# EasyEDA Pro project ProPrj_DCDC_LDO降压电路_2025-04-18.epro

# Schematic Schematic1
Board Name: Board1; Create Date: 2025-02-16; Page Name: P1; Project Name: 智能车主板; Schematic Name: Schematic1; Update Date: 2025-03-14; Company: 嘉立创EDA; Page Size: A4; Version: V1.0
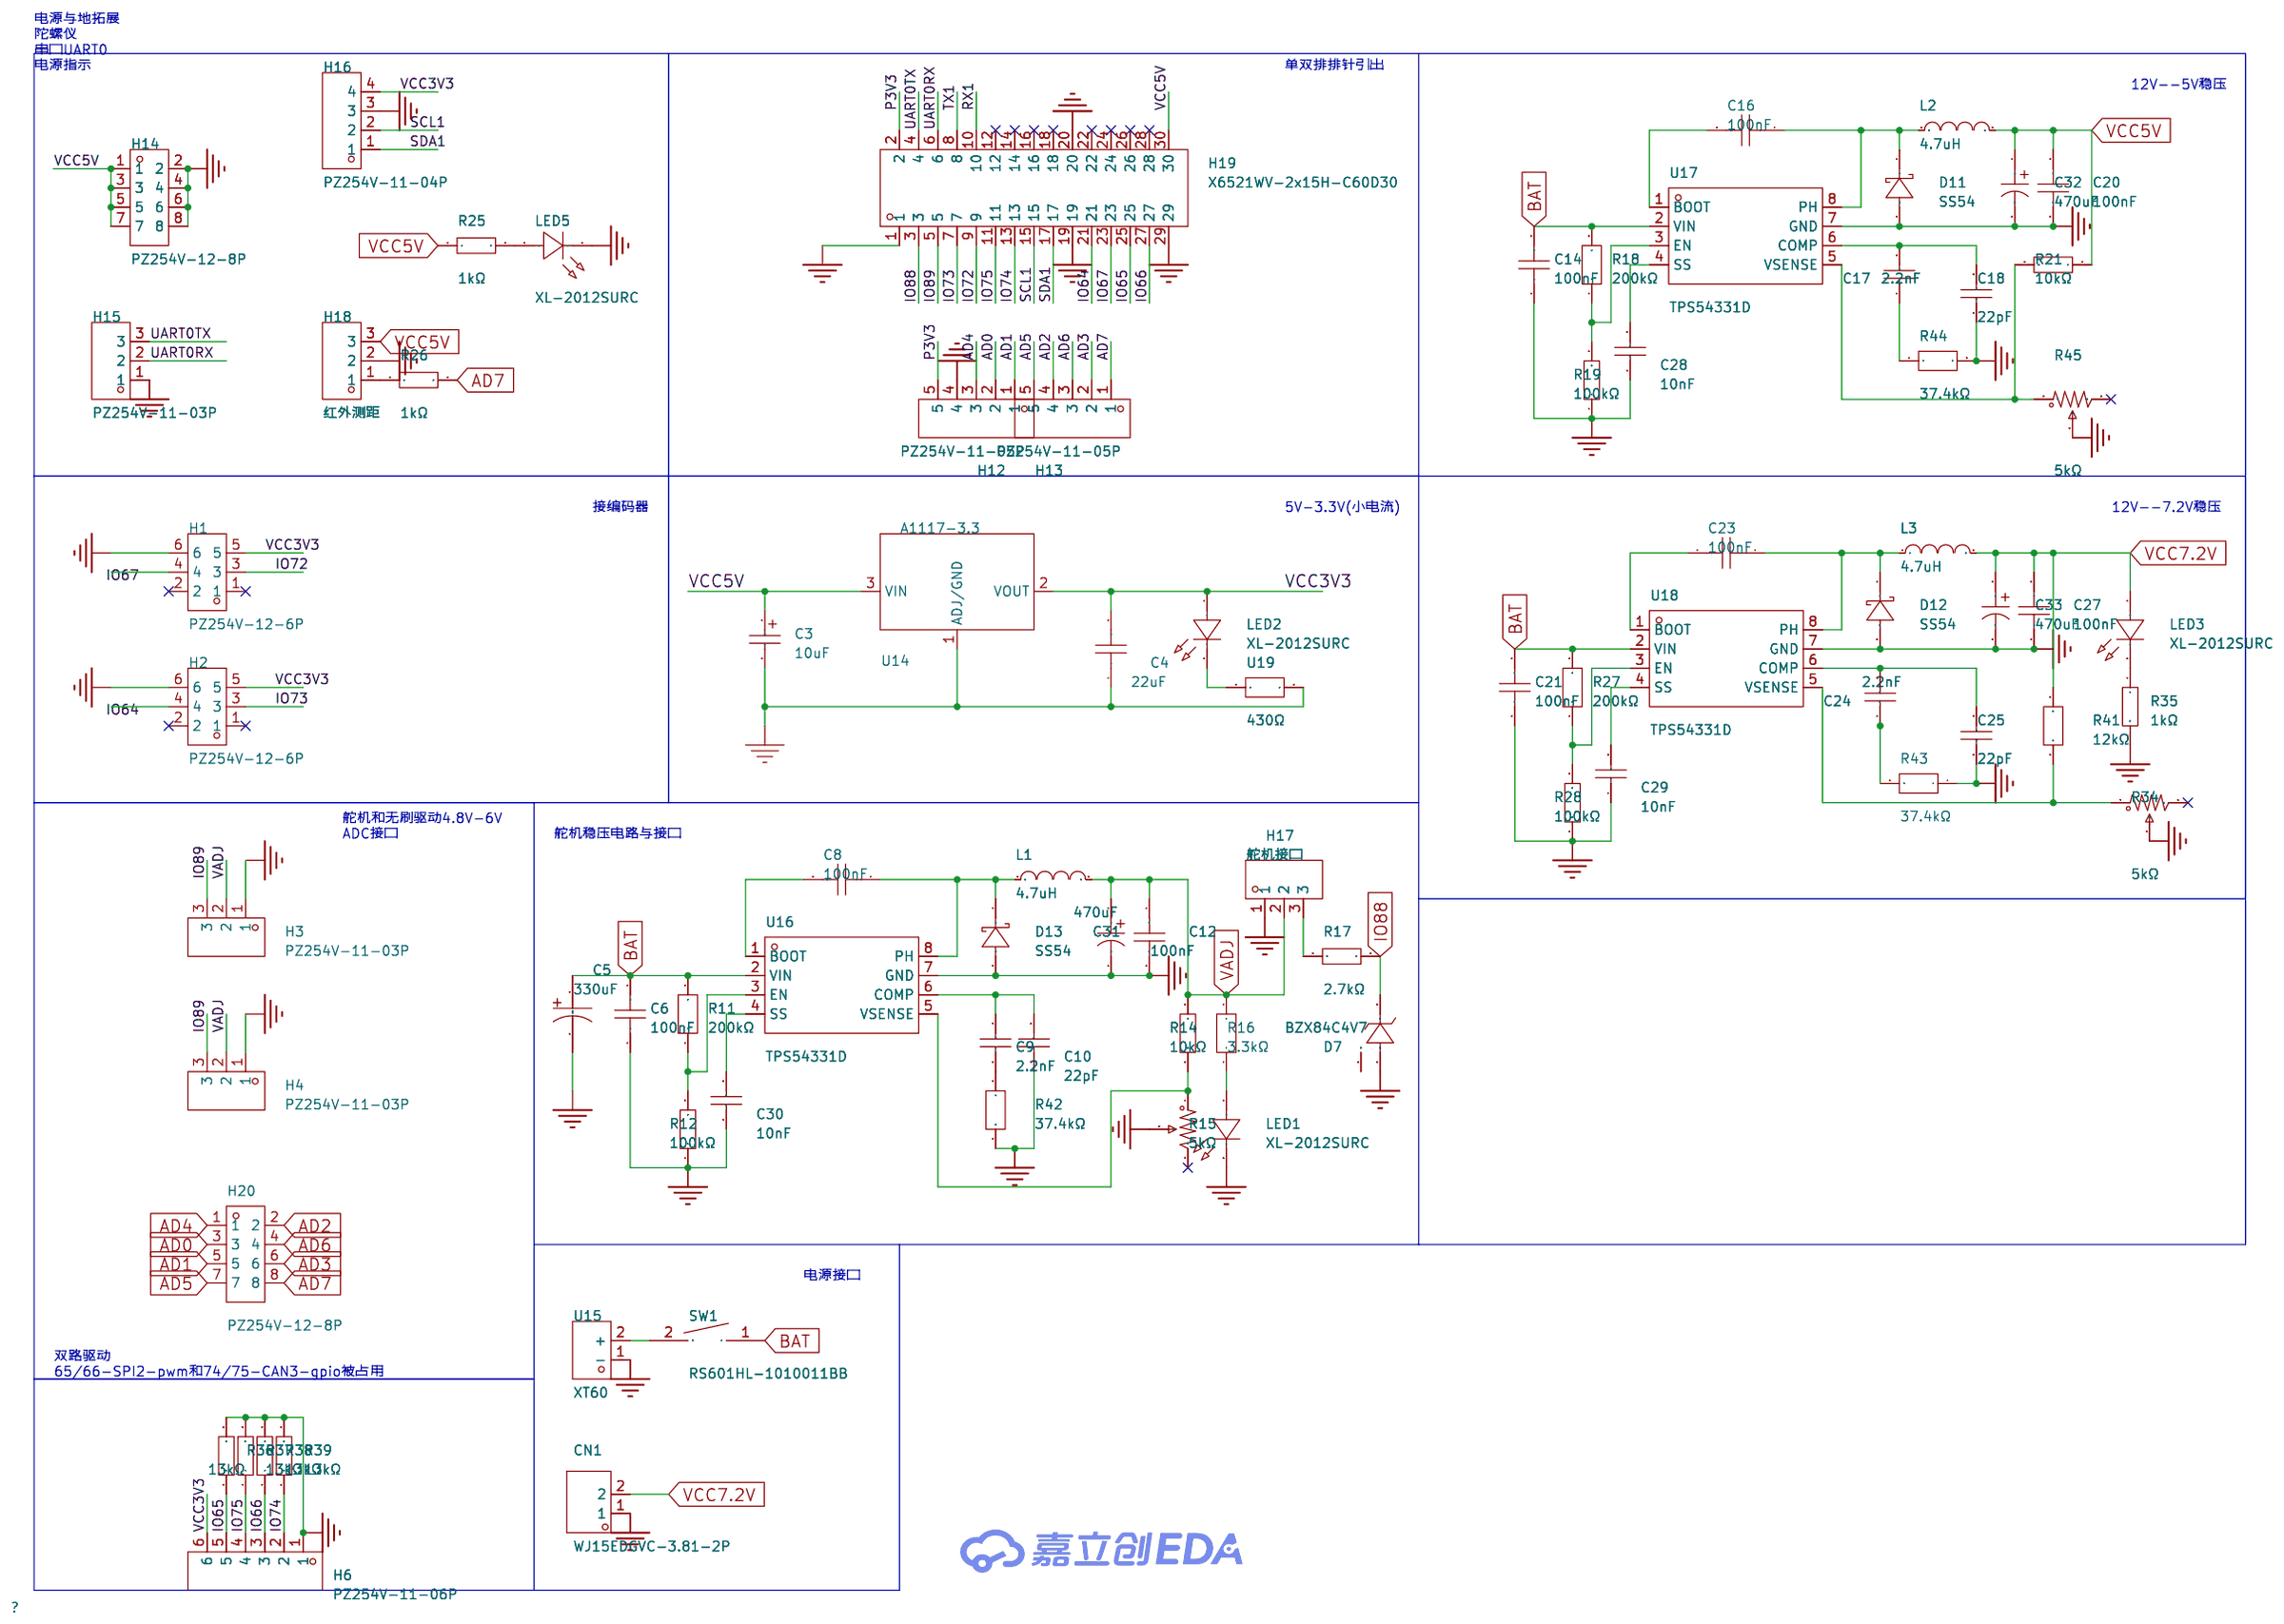
[diagram p0: schematic sheet]

## Parts
C3  10uF  [CAP-SMD_L6.0-W3.2]
C4  22uF  [C0805]
C5  330uF  [CAP-SMD_BD8.0-L8.3-W8.3-LS9.3-FD-1]
C6  100nF  [C0805]
C8  100nF  [C0805]
C9  2.2nF  [C0805]
C10  22pF  [C0603]
C12  100nF  [C0805]
C14  100nF  [C0805]
C16  100nF  [C0805]
C17  2.2nF  [C0805]
C18  22pF  [C0603]
C20  100nF  [C0805]
C21  100nF  [C0805]
C23  100nF  [C0805]
C24  2.2nF  [C0805]
C25  22pF  [C0603]
C27  100nF  [C0805]
C28  10nF  [C0805]
C29  10nF  [C0805]
C30  10nF  [C0805]
C31  470uF  [CAP-SMD_BD8.0-L8.3-W8.3-LS8.9-FD]
C32  470uF  [CAP-SMD_BD8.0-L8.3-W8.3-LS8.9-FD]
C33  470uF  [CAP-SMD_BD8.0-L8.3-W8.3-LS8.9-FD]
CN1  WJ15EDGVC-3.81-2P  [CONN-TH_WJ15EDGVC-3.81-2P]
D7  BZX84C4V7  [SOT-23-3_L2.9-W1.3-P1.90-LS2.4-BR]
D11  SS54  [SMA_L4.3-W2.6-LS5.0-RD]
D12  SS54  [SMA_L4.3-W2.6-LS5.0-RD]
D13  SS54  [SMA_L4.3-W2.6-LS5.0-RD]
H1  PZ254V-12-6P  [HDR-TH_6P-P2.54-V-M-R2-C3-S2.54]
H2  PZ254V-12-6P  [HDR-TH_6P-P2.54-V-M-R2-C3-S2.54]
H3  PZ254V-11-03P  [HDR-TH_3P-P2.54-V-M]
H4  PZ254V-11-03P  [HDR-TH_3P-P2.54-V-M]
H6  PZ254V-11-06P  [HDR-TH_6P-P2.54-V-M]
H12  PZ254V-11-05P  [HDR-TH_5P-P2.54-V-M]
H13  PZ254V-11-05P  [HDR-TH_5P-P2.54-V-M]
H14  PZ254V-12-8P  [HDR-TH_8P-P2.54-V-M-R2-C4-S2.54]
H15  PZ254V-11-03P  [HDR-TH_3P-P2.54-V-M]
H16  PZ254V-11-04P  [HDR-TH_4P-P2.54-V-M]
H17  舵机接口  [HDR-TH_3P-P2.54-V-M]
H18  红外测距  [HDR-TH_3P-P2.54-V-M]
H19  X6521WV-2x15H-C60D30  [HDR-TH_30P-P2.54-V-M-R2-C15-S2.54-BL]
H20  PZ254V-12-8P  [HDR-TH_8P-P2.54-V-M-R2-C4-S2.54]
L1  4.7uH  [IND-SMD_L7.3-W6.6_MHCI06030]
L2  4.7uH  [IND-SMD_L7.3-W6.6_MHCI06030]
L3  4.7uH  [IND-SMD_L7.3-W6.6_MHCI06030]
LED1  XL-2012SURC  [LED0805-R-RD]
LED2  XL-2012SURC  [LED0805-R-RD]
LED3  XL-2012SURC  [LED0805-R-RD]
LED5  XL-2012SURC  [LED0805-R-RD]
R11  200kΩ  [R0603]
R12  100kΩ  [R0805]
R14  10kΩ  [R0805]
R15  5kΩ  [RES-ADJ-TH_3P-L6.8-W4.6-P2.50-TL-BS-3266X]
R16  3.3kΩ  [R0805]
R17  2.7kΩ  [R0603]
R18  200kΩ  [R0603]
R19  100kΩ  [R0805]
R21  10kΩ  [R0805]
R25  1kΩ  [R0603]
R26  1kΩ  [R0603]
R27  200kΩ  [R0603]
R28  100kΩ  [R0805]
R34  5kΩ  [RES-ADJ-TH_3P-L6.8-W4.6-P2.50-TL-BS-3266X]
R35  1kΩ  [R0603]
R36  13kΩ  [R0805]
R37  13kΩ  [R0805]
R38  13kΩ  [R0805]
R39  13kΩ  [R0805]
R41  12kΩ  [R0805]
R42  37.4kΩ  [R0603]
R43  37.4kΩ  [R0603]
R44  37.4kΩ  [R0603]
R45  5kΩ  [RES-ADJ-TH_3P-L6.8-W4.6-P2.50-TL-BS-3266X]
SW1  RS601HL-1010011BB  [SW-TH_RS601HL-1010011BB]
U14  A1117-3.3  [asm1117]
U15  XT60  [CONN-TH_XT60]
U16  TPS54331D  [SOIC-8_L4.9-W3.9-P1.27-LS6.0-BL]
U17  TPS54331D  [SOIC-8_L4.9-W3.9-P1.27-LS6.0-BL]
U18  TPS54331D  [SOIC-8_L4.9-W3.9-P1.27-LS6.0-BL]
U19  430Ω  [R0805]

## Library data of the parts
C3 = TAJC106K016RNJ: 容值:10uF;精度:±10%;额定电压:16V;等效串联电阻:2Ω@100kHz;; LCSC Part Name: 10uF ±10% 16V; Supplier Part: C7209; Manufacturer: Kyocera AVX; Supplier Footprint: CASE-C-6032; JLCPCB Part Class: 扩展库; Datasheet: https://atta.szlcsc.com/upload/public/pdf/source/20160107/1457707750344.pdf; Supplier: LCSC; Tolerance: ±10%; Rated Voltage: 16V; Equivalent Series Resistance(ESR): 2Ω@100kHz; Operating Temperature: -55℃~+125℃
C4 = CGA0805X5R226M350MT: 容值:22uF;精度:±20%;额定电压:35V;材质(温度系数):X5R;; LCSC Part Name: 22uF ±20% 35V; Supplier Part: C6119901; Manufacturer: HRE(芯声); Supplier Footprint: 0805; JLCPCB Part Class: 扩展库; Datasheet: https://atta.szlcsc.com/upload/public/pdf/source/20231129/D589D0CC4D260F7AC3A77E53B455CCB3.pdf; Supplier: LCSC; Tolerance: ±20%; Voltage Rated: 35V; Temperature Coefficient: X5R
C5 = RVT1E331M0810_C335985: 容值:330uF;精度:±20%;额定电压:25V;纹波电流:228mA@120Hz;等效串联电阻(ESR):-;; LCSC Part Name: 330uF ±20% 25V; Supplier Part: C335985; Manufacturer: ROQANG(容强); Manufacturer Part: RVT1E331M0810; Supplier Footprint: SMD,D8xL10.2mm; JLCPCB Part Class: Extended Part; Datasheet: https://atta.szlcsc.com/upload/public/pdf/source/20181128/C335987_23CA7AA50FB42690DF736C43FE112376.pdf; Supplier: LCSC; Tolerance: ±20%; Voltage Rating: 25V; Ripple Current: 228mA@120Hz; Diameter: 8mm; Height - Seated (Max): 10.2mm; Lifetime: 2000hrs@105℃; Operating Temperature: -40℃~+105℃
C6 C8 C12 C14 C16 C20 C21 C23 C27 = CC0805KRX7R9BB104: 容值:100nF;精度:±10%;额定电压:50V;材质(温度系数):X7R;; LCSC Part Name: 100nF ±10% 50V; Supplier Part: C49678; Manufacturer: YAGEO(国巨); Supplier Footprint: 0805; JLCPCB Part Class: 基础库; Datasheet: https://atta.szlcsc.com/upload/public/pdf/source/20180224/C181747_15194369449651363981.pdf; Supplier: LCSC; Tolerance: ±10%; Voltage Rated: 50V; Temperature Coefficient: X7R
C9 C17 C24 = CL21C222JBFNNNE: 容值:2.2nF;精度:±5%;额定电压:50V;材质(温度系数):C0G;; LCSC Part Name: 2.2nF ±5% 50V; Supplier Part: C28260; Manufacturer: SAMSUNG(三星); Supplier Footprint: 0805; JLCPCB Part Class: 基础库; Datasheet: https://atta.szlcsc.com/upload/public/pdf/source/20160218/1457707763339.pdf; Supplier: LCSC; Tolerance: ±5%; Voltage Rated: 50V; Temperature Coefficient: C0G
C10 C18 C25 = CC0603JRNPO9BN220: 容值:22pF;精度:±5%;额定电压:50V;材质(温度系数):NP0;; LCSC Part Name: 22pF ±5% 50V; Supplier Part: C105620; Manufacturer: YAGEO(国巨); Supplier Footprint: 0603; JLCPCB Part Class: 扩展库; Datasheet: https://atta.szlcsc.com/upload/public/pdf/source/20170505/1493957838062.pdf; Supplier: LCSC; Tolerance: ±5%; Voltage Rated: 50V; Temperature Coefficient: NP0
C28-C30 = CL21B103KBANNNC: 容值:10nF;精度:±10%;额定电压:50V;材质(温度系数):X7R;; LCSC Part Name: 10nF ±10% 50V; Supplier Part: C1710; Manufacturer: SAMSUNG(三星); Supplier Footprint: 0805; JLCPCB Part Class: 基础库; Datasheet: https://atta.szlcsc.com/upload/public/pdf/source/20160218/1457707763339.pdf; Supplier: LCSC; Tolerance: ±10%; Voltage Rated: 50V; Temperature Coefficient: X7R
C31-C33 = CK1C471M-CRF10_C5162359: 容值:470uF;精度:±20%;额定电压:16V;纹波电流:240mA@120Hz;; LCSC Part Name: 470uF ±20% 16V; Supplier Part: C5162359; Manufacturer: ROQANG(容强); Manufacturer Part: CK1C471M-CRF10; Supplier Footprint: SMD,D8xL10.5mm; JLCPCB Part Class: Extended Part; Datasheet: https://atta.szlcsc.com/upload/public/pdf/source/20220915/8032839608EC75446813685B95DE3107.pdf; Supplier: LCSC; Tolerance: ±20%; Voltage Rating: 16V; Ripple Current: 240mA@120Hz; Diameter: 8mm; Height - Seated (Max): 10.5mm; Lifetime: 2000hrs@105℃; Operating Temperature: -40℃~+105℃
CN1 = WJ15EDGVC-3.81-2P: 连接器类型:板端/插座-闭口;固定方式:-;结构:1x2P;间距:3.81mm;颜色:-;安装方式:直针;排数:1;每排PIN数:2;额定电流:8A;额定电压:300V;线规 - AWG:-;线规 - 平方毫米:-;触头材质:黄铜;触头镀层:锡;工作温度范围:-40℃~+105℃;焊接温度(最大值):-;; LCSC Part Name: 1x2P 3.81mm 排数:1 每排P数:2; Supplier Part: C8396; Manufacturer: KANGNEX(康奈克斯电气); Supplier Footprint: 插件,P=3.81mm; JLCPCB Part Class: 扩展库; Datasheet: https://atta.szlcsc.com/upload/public/pdf/source/20191225/C8396_DFFE6D58C2AF45781C2AF0BF2B733CCC.pdf; Supplier: LCSC; Connector Type: 板端/插座-闭口; Structure: 1x2P; Pitch: 3.81mm; Mounting Style: 直针; Number of Pins: 2P; Number of Rows: 1; Number of PINs Per Row: 2; Current Rating (Max): 8A; Voltage Rating (Max): 300V; Contact Material: 黄铜; Contact Plating: 锡; Operating Temperature Range: -40℃~+105℃
D7 = BZX84C4V7_C841158: 二极管配置:独立式;稳压值(标称值):4.7V;稳压值(范围):4.4V~5V;耗散功率(Pd):350mW;; LCSC Part Name: 丝印Z1 BZX84C4V7; Supplier Part: C841158; Manufacturer: LGE(鲁光); Supplier Footprint: SOT-23; JLCPCB Part Class: 扩展库; Datasheet: https://atta.szlcsc.com/upload/public/pdf/source/20200521/C545312_81C845D7ABF6A946CB07E989BC227756.pdf; Supplier: LCSC; Diode Configuration: 独立式; Zener Voltage(Nom): 4.7V; Reverse Leakage Current (Ir): 3uA@2V; Zener Voltage(Range): 4.4V~5V; Pd - Power Dissipation: 350mW; Impedance(Zzt): 80Ω
D11-D13 = SS54_C727065: 二极管配置:独立式;正向压降(Vf):550mV@5A;直流反向耐压(Vr):40V;整流电流:5A;; LCSC Part Name: 电压:40V 电流:5A; Supplier Part: C727065; Manufacturer: TWGMC(台湾迪嘉); Supplier Footprint: SMA(DO-214AC); JLCPCB Part Class: 扩展库; Datasheet: https://atta.szlcsc.com/upload/public/pdf/source/20200828/C727064_BD0A2B36CBC76CEA4B6710C57718D41F.pdf; Supplier: LCSC; Diode Configuration: 独立式; Forward Voltage (Vf@If): 550mV@5A; Reverse Voltage (Vr): 40V; Rectified Current: 5A; Reverse Leakage Current (Ir): 500uA
H1 H2 = PZ254V-12-6P: 插针结构:2x3P;间距:2.54mm;行距:2.54mm;圆针/方针:方针;安装类型:直插;排数:双排;总PIN位数:6P;额定电流:-;额定电压:-;配合针长度:6mm;塑高:2.5mm;端接针长度:3mm;触头材质:黄铜;触头镀层:-;工作温度范围:-40℃~+105℃;颜色:黑色;; LCSC Part Name: 间距:2.54mm 2x3P 直插 方针; Supplier Part: C492420; Manufacturer: XFCN(兴飞); Supplier Footprint: 插件,P=2.54mm; JLCPCB Part Class: 扩展库; Datasheet: https://atta.szlcsc.com/upload/public/pdf/source/20200309/C492420_BAECB307B001054C09D200388220EAE6.pdf; Supplier: LCSC; Pin Structure: 2x3P; Pitch: 2.54mm; Row Spacing: 2.54mm; Circluar Pins/Square Pins: 方针; Mounting Type: 直插; Number of Rows: 双排; Number of Pins: 6P; Length of Mating Pin: 6mm; Insulation Height: 2.5mm; Length of End Connection Pin: 3mm; Contact Material: 黄铜; Operating Temperature Range: -40℃~+105℃; Color: 黑色
H3 H4 H15 H17 H18 = PZ254V-11-03P: 插针结构:1x3P;间距:2.54mm;行距:-;圆针/方针:方针;安装类型:直插;排数:单排;总PIN位数:3P;额定电流:3A;额定电压:250V;配合针长度:6mm;塑高:2.5mm;端接针长度:3mm;工作温度范围:-40℃~+105℃;颜色:黑色;; LCSC Part Name: 间距:2.54mm 1x3P 直插 方针; Supplier Part: C2937625; Manufacturer: XFCN(兴飞); Supplier Footprint: 插件,P=2.54mm; JLCPCB Part Class: 扩展库; Datasheet: https://atta.szlcsc.com/upload/public/pdf/source/20200309/C492402_8335C3D49C4E4C618838D59BB1D024C1.pdf; Supplier: LCSC; Pin Structure: 1x3P; Pitch: 2.54mm; Circluar Pins/Square Pins: 方针; Mounting Type: 直插; Number of Rows: 单排; Number of Pins: 3P; Current Rating (Max): 3A; Voltage Rating (Max): 250V; Length of Mating Pin: 6mm; Insulation Height: 2.5mm; Length of End Connection Pin: 3mm; Operating Temperature Range: -40℃~+105℃; Color: 黑色
H6 = PZ254V-11-06P: 插针结构:1x6P;间距:2.54mm;行距:-;圆针/方针:方针;安装类型:直插;排数:单排;总PIN位数:6P;额定电流:-;额定电压:-;配合针长度:6mm;塑高:2.5mm;端接针长度:3mm;触头材质:黄铜;触头镀层:-;工作温度范围:-40℃~+105℃;颜色:黑色;; LCSC Part Name: 间距:2.54mm 1x6P 直插 方针; Supplier Part: C492405; Manufacturer: XFCN(兴飞); Supplier Footprint: 插件,P=2.54mm; JLCPCB Part Class: 扩展库; Datasheet: https://atta.szlcsc.com/upload/public/pdf/source/20200309/C492405_597F1930F5B55CC3C7FD95458F1C3977.pdf; Supplier: LCSC; Pin Structure: 1x6P; Pitch: 2.54mm; Circluar Pins/Square Pins: 方针; Mounting Type: 直插; Number of Rows: 单排; Number of Pins: 6P; Length of Mating Pin: 6mm; Insulation Height: 2.5mm; Length of End Connection Pin: 3mm; Contact Material: 黄铜; Operating Temperature Range: -40℃~+105℃; Color: 黑色
H12 H13 = PZ254V-11-05P: 插针结构:1x5P;间距:2.54mm;行距:-;圆针/方针:方针;安装类型:直插;排数:单排;总PIN位数:5P;额定电流:-;额定电压:-;配合针长度:6mm;塑高:2.5mm;端接针长度:3mm;触头材质:黄铜;触头镀层:-;工作温度范围:-40℃~+105℃;颜色:黑色;; LCSC Part Name: 间距:2.54mm 1x5P 直插 方针; Supplier Part: C492404; Manufacturer: XFCN(兴飞); Supplier Footprint: 插件,P=2.54mm; JLCPCB Part Class: 扩展库; Datasheet: https://atta.szlcsc.com/upload/public/pdf/source/20200309/C492404_E51533260F8710EFF5D4617281164C1D.pdf; Supplier: LCSC; Pin Structure: 1x5P; Pitch: 2.54mm; Circluar Pins/Square Pins: 方针; Mounting Type: 直插; Number of Rows: 单排; Number of Pins: 5P; Length of Mating Pin: 6mm; Insulation Height: 2.5mm; Length of End Connection Pin: 3mm; Contact Material: 黄铜; Operating Temperature Range: -40℃~+105℃; Color: 黑色
H14 H20 = PZ254V-12-8P: 插针结构:2x4P;间距:2.54mm;行距:2.54mm;圆针/方针:方针;安装类型:直插;排数:双排;总PIN位数:8P;额定电流:-;额定电压:-;配合针长度:6mm;塑高:2.5mm;端接针长度:3mm;触头材质:黄铜;触头镀层:-;工作温度范围:-40℃~+105℃;颜色:黑色;; LCSC Part Name: 间距:2.54mm 2x4P 直插 方针; Supplier Part: C492421; Manufacturer: XFCN(兴飞); Supplier Footprint: 插件,P=2.54mm; JLCPCB Part Class: 扩展库; Datasheet: https://atta.szlcsc.com/upload/public/pdf/source/20200309/C492421_DC8A206AF99CD7755BD4A5B0BC48200B.pdf; Supplier: LCSC; Pin Structure: 2x4P; Pitch: 2.54mm; Row Spacing: 2.54mm; Circluar Pins/Square Pins: 方针; Mounting Type: 直插; Number of Rows: 双排; Number of Pins: 8P; Length of Mating Pin: 6mm; Insulation Height: 2.5mm; Length of End Connection Pin: 3mm; Contact Material: 黄铜; Operating Temperature Range: -40℃~+105℃; Color: 黑色
H16 = PZ254V-11-04P: 插针结构:1x4P;间距:2.54mm;行距:-;圆针/方针:方针;安装类型:直插;排数:单排;总PIN位数:4P;额定电流:3A;额定电压:250V;配合针长度:6mm;塑高:2.5mm;端接针长度:3mm;触头材质:-;工作温度范围:-40℃~+105℃;颜色:黑色;; LCSC Part Name: 间距:2.54mm 1x4P 直插 方针; Supplier Part: C2691448; Manufacturer: XFCN(兴飞); Supplier Footprint: 插件,P=2.54mm; JLCPCB Part Class: 扩展库; Datasheet: https://atta.szlcsc.com/upload/public/pdf/source/20200309/C492403_F9F19131791D08044AD4F84F8E751A34.pdf; Supplier: LCSC; Pin Structure: 1x4P; Pitch: 2.54mm; Circluar Pins/Square Pins: 方针; Mounting Type: 直插; Number of Rows: 单排; Number of Pins: 4P; Current Rating (Max): 3A; Voltage Rating (Max): 250V; Length of Mating Pin: 6mm; Insulation Height: 2.5mm; Length of End Connection Pin: 3mm; Operating Temperature Range: -40℃~+105℃; Color: 黑色
H19 = X6521WV-2x15H-C60D30: 插针结构:2x15P;间距:2.54mm;行距:2.54mm;圆针/方针:方针;安装类型:-;排数:双排;总PIN位数:30P;额定电流:3A;额定电压:250V;配合针长度:-;塑高:2.5mm;端接针长度:-;触头材质:黄铜;触头镀层:金;工作温度范围:-40℃~+105℃;焊接温度(最大值):260℃;颜色:黑色;; LCSC Part Name: 2x15P 间距:2.54mm 方针; Supplier Part: C725887; Manufacturer: XKB Connection(中国星坤); Supplier Footprint: 插件,P=2.54mm; JLCPCB Part Class: 扩展库; Datasheet: https://atta.szlcsc.com/upload/public/pdf/source/20230814/F1C4971E164A170E66FC7330ABFF6881.pdf; Supplier: LCSC; Pin Structure: 2x15P; Pitch: 2.54mm; Row Spacing: 2.54mm; Circluar Pins/Square Pins: 方针; Number of Rows: 双排; Number of Pins: 30P; Current Rating (Max): 3A; Voltage Rating (Max): 250V; Insulation Height: 2.5mm; Contact Material: 黄铜; Contact Plating: 金; Operating Temperature Range: -40℃~+105℃; Soldering Temperature(Max): 260℃; Color: 黑色
L1-L3 = SLO0630H4R7MTT: 电感值:4.7uH;精度:±20%;额定电流:5.5A;; LCSC Part Name: 4.7uH ±20%; Supplier Part: C207840; Manufacturer: Sunltech(韩国顺磁); Supplier Footprint: SMD,6.6x7.1mm; JLCPCB Part Class: 扩展库; Datasheet: https://atta.szlcsc.com/upload/public/pdf/source/20190925/C207844_D5F1113EB7E791F3C24FBC0C5D2BA774.pdf; Supplier: LCSC; Tolerance: ±20%; Rated Current: 5.5A; DC Resistance (DCR): 38mΩ
LED1-LED3 LED5 = XL-2012SURC: 发光颜色:红色;功率:55mW;正向电流:25mA;主波长:617nm~621nm;透镜颜色:无色透明透镜;色温:-;发光角度:120°;载带方式:正贴;工作温度:-30℃~+85℃;; Supplier Part: C965812; Manufacturer: XINGLIGHT(成兴光); Supplier Footprint: 0805; JLCPCB Part Class: 扩展库; Datasheet: https://atta.szlcsc.com/upload/public/pdf/source/20221102/49E1A0A365644091E6270AF1C5E0FE37.pdf; Supplier: LCSC; Emitted Color: 红色; Power Dissipation: 55mW; Forward Current: 25mA; Dominant Wavelength: 617nm~621nm; Peak Wavelength: 623nm; Lens Color: 无色透明透镜; Viewing Angle: 120°; Mounting Sytle: 正贴; Operating Temperature: -30℃~+85℃
R11 R18 R27 = FRC0603F2003TS: 电阻类型:厚膜电阻;阻值:200kΩ;精度:±1%;功率:100mW;工作电压:75V;温度系数:±100ppm/℃;; LCSC Part Name: 200kΩ ±1% 100mW 厚膜电阻; Supplier Part: C2907009; Manufacturer: FOJAN(富捷); Supplier Footprint: 0603; JLCPCB Part Class: 扩展库; Datasheet: https://atta.szlcsc.com/upload/public/pdf/source/20211221/925EC7D7225764EE0046F22065062C87.pdf; Supplier: LCSC; Type: 厚膜电阻; Tolerance: ±1%; Power(Watts): 100mW; Voltage-Supply(Max): 75V; Temperature Coefficient: ±100ppm/℃; Operating Temperature: -55℃~+155℃
R12 R19 R28 = 0805W8F1003T5E: 电阻类型:厚膜电阻;阻值:100kΩ;精度:±1%;功率:125mW;最大工作电压:150V;温度系数:±100ppm/℃;; LCSC Part Name: 100kΩ ±1% 125mW 厚膜电阻; Supplier Part: C149504; Manufacturer: UNI-ROYAL(厚声); Supplier Footprint: 0805; JLCPCB Part Class: 基础库; Datasheet: https://atta.szlcsc.com/upload/public/pdf/source/20200306/C422600_1E6D84923E4A46A82E41ADD87F860B5C.pdf; Supplier: LCSC; Type: 厚膜电阻; Tolerance: ±1%; Power(Watts): 125mW; Overload Voltage (Max): 150V; Temperature Coefficient: ±100ppm/℃; Operating Temperature Range: -55℃~+155℃
R14 R21 = 0805W8F1002T5E_C17414: 电阻类型:厚膜电阻;阻值:10kΩ;精度:±1%;功率:125mW;最大工作电压:150V;温度系数:±100ppm/℃;; LCSC Part Name: 10kΩ ±1% 125mW 厚膜电阻; Supplier Part: C17414; Manufacturer: UNI-ROYAL(厚声); Manufacturer Part: 0805W8F1002T5E; Supplier Footprint: 0805; JLCPCB Part Class: 基础库; Datasheet: https://atta.szlcsc.com/upload/public/pdf/source/20200306/C422600_1E6D84923E4A46A82E41ADD87F860B5C.pdf; Supplier: LCSC; Type: 厚膜电阻; Tolerance: ±1%; Power(Watts): 125mW; Overload Voltage (Max): 150V; Temperature Coefficient: ±100ppm/℃; Operating Temperature Range: -55℃~+155℃
R15 R34 R45 = 3266X-1-502LF: 阻值:5kΩ;精度:±10%;功率:250mW;温度系数:±100ppm/℃;; LCSC Part Name: 5kΩ ±10%; Supplier Part: C780223; Manufacturer: BOURNS; Supplier Footprint: 插件-3P,6.4x4.3mm; JLCPCB Part Class: 扩展库; Datasheet: https://atta.szlcsc.com/upload/public/pdf/source/20200907/C462144_DF8D44480140B6FE24360552451E91FC.pdf; Supplier: LCSC; Tolerance: ±10%; Power(Watts): 250mW; Temperature Coefficient: ±100ppm/℃; Turns: 12
R16 = FRC0805F3301TS: 电阻类型:厚膜电阻;阻值:3.3kΩ;精度:±1%;功率:125mW;最大工作电压:150V;温度系数:±100ppm/℃;; LCSC Part Name: 3.3kΩ ±1% 125mW 厚膜电阻; Supplier Part: C2907249; Manufacturer: FOJAN(富捷); Supplier Footprint: 0805; JLCPCB Part Class: 扩展库; Datasheet: https://atta.szlcsc.com/upload/public/pdf/source/20211221/925EC7D7225764EE0046F22065062C87.pdf; Supplier: LCSC; Type: 厚膜电阻; Tolerance: ±1%; Power(Watts): 125mW; Overload Voltage (Max): 150V; Temperature Coefficient: ±100ppm/℃; Operating Temperature Range: -55℃~+155℃
R17 = 0603WAF2701T5E: 电阻类型:厚膜电阻;阻值:2.7kΩ;精度:±1%;功率:100mW;最大工作电压:75V;温度系数:±100ppm/℃;; LCSC Part Name: 2.7kΩ ±1% 100mW 厚膜电阻; Supplier Part: C13167; Manufacturer: UNI-ROYAL(厚声); Supplier Footprint: 0603; JLCPCB Part Class: 基础库; Datasheet: https://atta.szlcsc.com/upload/public/pdf/source/20200306/C422600_1E6D84923E4A46A82E41ADD87F860B5C.pdf; Supplier: LCSC; Type: 厚膜电阻; Tolerance: ±1%; Power(Watts): 100mW; Overload Voltage (Max): 75V; Temperature Coefficient: ±100ppm/℃; Operating Temperature Range: -55℃~+155℃
R25 R26 = 0603WAF1001T5E: 电阻类型:厚膜电阻;阻值:1kΩ;精度:±1%;功率:100mW;最大工作电压:75V;温度系数:±100ppm/℃;; LCSC Part Name: 1kΩ ±1% 100mW 厚膜电阻; Supplier Part: C21190; Manufacturer: UNI-ROYAL(厚声); Supplier Footprint: 0603; JLCPCB Part Class: 基础库; Datasheet: https://atta.szlcsc.com/upload/public/pdf/source/20200306/C422600_1E6D84923E4A46A82E41ADD87F860B5C.pdf; Supplier: LCSC; Type: 厚膜电阻; Tolerance: ±1%; Power(Watts): 100mW; Overload Voltage (Max): 75V; Temperature Coefficient: ±100ppm/℃; Operating Temperature Range: -55℃~+155℃
R35 = 0603WAF5100T5E: 电阻类型:厚膜电阻;阻值:510Ω;精度:±1%;功率:100mW;最大工作电压:75V;温度系数:±100ppm/℃;; LCSC Part Name: 510Ω ±1% 100mW 厚膜电阻; Supplier Part: C23193; Manufacturer: UNI-ROYAL(厚声); Supplier Footprint: 0603; JLCPCB Part Class: 基础库; Datasheet: https://atta.szlcsc.com/upload/public/pdf/source/20200306/C422600_1E6D84923E4A46A82E41ADD87F860B5C.pdf; Supplier: LCSC; Type: 厚膜电阻; Tolerance: ±1%; Power(Watts): 100mW; Overload Voltage (Max): 75V; Temperature Coefficient: ±100ppm/℃; Operating Temperature Range: -55℃~+155℃
R36-R39 = 0805W8F1302T5E: 电阻类型:厚膜电阻;阻值:13kΩ;精度:±1%;功率:125mW;最大工作电压:150V;温度系数:±100ppm/℃;; LCSC Part Name: 13kΩ ±1% 125mW 厚膜电阻; Supplier Part: C17455; Manufacturer: UNI-ROYAL(厚声); Supplier Footprint: 0805; JLCPCB Part Class: 扩展库; Datasheet: https://atta.szlcsc.com/upload/public/pdf/source/20200306/C422600_1E6D84923E4A46A82E41ADD87F860B5C.pdf; Supplier: LCSC; Type: 厚膜电阻; Tolerance: ±1%; Power(Watts): 125mW; Overload Voltage (Max): 150V; Temperature Coefficient: ±100ppm/℃; Operating Temperature Range: -55℃~+155℃
R41 = FRC0805F1202TS: 电阻类型:厚膜电阻;阻值:12kΩ;精度:±1%;功率:125mW;最大工作电压:150V;温度系数:±100ppm/℃;; LCSC Part Name: 12kΩ ±1% 125mW 厚膜电阻; Supplier Part: C2907225; Manufacturer: FOJAN(富捷); Supplier Footprint: 0805; JLCPCB Part Class: 扩展库; Datasheet: https://atta.szlcsc.com/upload/public/pdf/source/20211221/925EC7D7225764EE0046F22065062C87.pdf; Supplier: LCSC; Type: 厚膜电阻; Tolerance: ±1%; Power(Watts): 125mW; Overload Voltage (Max): 150V; Temperature Coefficient: ±100ppm/℃; Operating Temperature Range: -55℃~+155℃
R42-R44 = RN73R1JTTD3702C25: 电阻类型:薄膜电阻;阻值:37kΩ;精度:±0.25%;功率:100mW;最大工作电压:75V;温度系数:±25ppm/℃;; LCSC Part Name: 薄膜电阻 37kΩ ±0.25% 100mW; Supplier Part: C2517971; Manufacturer: KOA; Supplier Footprint: 0603; JLCPCB Part Class: 扩展库; Datasheet: https://atta.szlcsc.com/upload/public/pdf/source/20210531/098CC3F3FCFB64C44C5D5A5059E9C1A2.pdf; Supplier: LCSC; Type: 薄膜电阻; Tolerance: ±0.25%; Power(Watts): 100mW; Overload Voltage (Max): 75V; Temperature Coefficient: ±25ppm/℃; Operating Temperature Range: -55℃~+155℃
SW1 = RS601HL-1010011BB: 带灯:无;引脚样式:焊片;额定电流:3A;额定电压(AC):250V;额定电压(DC):-;电路结构:单刀单掷;机械寿命:1万次;; Supplier Part: C2885782; Manufacturer: HCTL(华灿天禄); Supplier Footprint: 插件; JLCPCB Part Class: 扩展库; Datasheet: https://atta.szlcsc.com/upload/public/pdf/source/20210820/B1970E40D09304D7FA648AE2099FB3E8.pdf; Supplier: LCSC; Switch Length: 15mm; Switch Width: 10.5mm; Switch Height: 11.7mm; Actuator Type: 凹面弯曲; With Lamp: 无; Pin Style: 焊片; Actuator Color: 黑色; Contact Current: 3A; Voltage Rating (AC): 250V; Circuit: 单刀单掷; Mechanical Life: 1万次; Operating Temperature: -25℃~+85℃; Actuator Identifier: - O
U14 = A1117-3.3: LCSC Part Name: AMS1117-3.3; Supplier Part: C7432020; Manufacturer: IDCHIP(英锐芯); Supplier Footprint: SOT-223; Datasheet: https://atta.szlcsc.com/upload/public/pdf/source/20230625/435FEEFA02C0FE449E7397A11F8448E0.pdf; Supplier: LCSC; link: https://atta.szlcsc.com/upload/public/pdf/source/20230625/435FEEFA02C0FE449E7397A11F8448E0.pdf; Library Name: 工训小车
U15 = XT60: 类别:-;类型1:-;; LCSC Part Name: AMASS(艾迈斯) XT60模型插头 3.5mm镀金香蕉头公头（电调端）XT60-M; Supplier Part: C98733; Manufacturer: AMASS(艾迈斯); JLCPCB Part Class: 扩展库; Datasheet: https://atta.szlcsc.com/upload/public/pdf/source/20170606/1496716524919.pdf; Supplier: LCSC; Brand: 艾迈斯; Type: 香蕉头; Colour: 黄色; InterfaceType: 公头; specifications: 3.5mm
U16-U18 = TPS54331D: 功能类型:降压型;输出类型:可调;输入电压:3.5V~28V;输出电压:-;输出电流:3A;; LCSC Part Name: 3A、28V 输入、直流/直流降压转换器; Supplier Part: C2872693; Manufacturer: TI(德州仪器); Supplier Footprint: SOIC-8; JLCPCB Part Class: 扩展库; Datasheet: https://www.ti.com/cn/lit/gpn/tps54331; Supplier: LCSC; Function: 降压型; Output Type: 可调; Input Voltage: 3.5V~28V; Output Current: 3A; Switching Frequency: 570kHz; Operating Temperature: -40℃~+150℃; Synchronous Rectification: 否; Number of Outputs: 1; Topology: 降压式; Quiescent Current (Iq): 1uA; Switch tube (built-in/external): 内置
U19 = FRC0805F4300TS: 电阻类型:厚膜电阻;阻值:430Ω;精度:±1%;功率:125mW;最大工作电压:150V;温度系数:±100ppm/℃;; LCSC Part Name: 430Ω ±1% 125mW 厚膜电阻; Supplier Part: C2907265; Manufacturer: FOJAN(富捷); Supplier Footprint: 0805; JLCPCB Part Class: 扩展库; Datasheet: https://atta.szlcsc.com/upload/public/pdf/source/20211221/925EC7D7225764EE0046F22065062C87.pdf; Supplier: LCSC; Type: 厚膜电阻; Tolerance: ±1%; Power(Watts): 125mW; Overload Voltage (Max): 150V; Temperature Coefficient: ±100ppm/℃; Operating Temperature Range: -55℃~+155℃

## Nets
GND: C3.2 C4.1 C5.2 C6.1 C10.1 C12.2 C14.1 C18.1 C20.2 C21.1 C25.1 C27.2 C28.1 C29.1 C30.1 C31.2 C32.2 C33.2 CN1.1 D7.1(A) D11.2 D12.2 D13.2 H1.6 H2.6 H3.1 H4.1 H6.1 H12.4 H14.2 H14.4 H14.6 H14.8 H15.1 H16.3 H17.1 H18.2 H19.1 H19.19 H19.20 H19.29 LED1.2(K) LED5.2(K) R12.1 R15.2 R19.1 R28.1 R34.2 R35.2 R36.2 R37.2 R38.2 R39.2 R42.1 R43.1 R44.2 R45.2 U14.1(ADJ/GND) U15.1(-) U16.7(GND) U17.7(GND) U18.7(GND) U19.2
P3V3: H12.5 H19.2
VCC3V3: C4.2 H1.5 H2.5 H6.6 H16.4 LED2.1(A) U14.2(VOUT)
VCC5V: C3.1 C20.1 C32.1 H14.1 H14.3 H14.5 H14.7 H18.3 H19.30 L2.2 R21.1 R25.1 U14.3(VIN)
VCC7.2V: C27.1 C33.1 CN1.2 L3.2 LED3.1(A) R41.2
AD0: H12.2 H20.3
AD1: H12.1 H20.5
AD2: H13.4 H20.2
AD3: H13.2 H20.6
AD4: H12.3 H20.1
AD5: H13.5 H20.7
AD6: H13.3 H20.4
AD7: H13.1 H20.8 R26.2
BAT: C5.1 C6.2 C14.2 C21.2 R11.2 R18.2 R27.2 SW1.1 U16.2(VIN) U17.2(VIN) U18.2(VIN)
IO64: H2.4 H19.21
IO65: H6.5 H19.25 R36.1
IO66: H6.3 H19.27 R38.1
IO67: H1.4 H19.23
IO72: H1.3 H19.9
IO73: H2.3 H19.7
IO74: H6.2 H19.13 R39.1
IO75: H6.4 H19.11 R37.1
IO88: D7.3(C) H19.3 R17.1
IO89: H3.3 H4.3 H19.5
RX1: H19.10
SCL1: H16.2 H19.15
SDA1: H16.1 H19.17
TX1: H19.8
UART0RX: H15.2 H19.6
UART0TX: H15.3 H19.4
VADJ: C12.1 C31.1 H3.2 H4.2 H17.2 L1.2 R14.2 R16.2
VSESE: R34.1 R41.1 U18.5(VSENSE)
$1N5106: LED2.2(K) U19.1
$1N8621: R11.1 R12.2 U16.3(EN)
$1N9019: C30.2 U16.4(SS)
$1N9100: C8.2 U16.1(BOOT)
$1N9333: C9.2 C10.2 U16.6(COMP)
$1N9888: R14.1 R15.1 U16.5(VSENSE)
$1N10078: C8.1 D13.1 L1.1 U16.8(PH)
$1N11574: R18.1 R19.2 U17.3(EN)
$1N11589: C28.2 U17.4(SS)
$1N11592: C16.2 U17.1(BOOT)
$1N11595: C17.1 R44.1
$1N11601: C17.2 C18.2 U17.6(COMP)
$1N11624: C16.1 D11.1 L2.1 U17.8(PH)
$1N11734: R21.2 R45.1 U17.5(VSENSE)
$1N14868: R27.1 R28.2 U18.3(EN)
$1N14871: C29.2 U18.4(SS)
$1N14872: C23.2 U18.1(BOOT)
$1N14873: C24.1 R43.2
$1N14875: C24.2 C25.2 U18.6(COMP)
$1N14877: C23.1 D12.1 L3.1 U18.8(PH)
$1N31767: C9.1 R42.2
$1N44983: LED5.1(A) R25.2
Net-(H17-3): H17.3 R17.2
Net-(H18-1): H18.1 R26.1
Net-(LED1-1): LED1.1(A) R16.1
Net-(LED3-2): LED3.2(K) R35.1
Net-(SW1-2): SW1.2 U15.2(+)

Not connected (* = marked no-connect by the designer): D7 2(NC); H1 1* 2*; H2 1* 2*; H19 12* 14* 16* 18* 22* 24* 26* 28*; R15 3*; R34 3*; R45 3*

## Notes on the sheet
- 电源与地拓展
  陀螺仪
  串口UART0
  电源指示
- 单双排排针引出
- 12V--5V稳压
- 接编码器
- 5V-3.3V(小电流)
- 12V--7.2V稳压
- 舵机和无刷驱动4.8V-6V
  ADC接口
- 舵机稳压电路与接口
- 电源接口
- 双路驱动
  65/66-SPI2-pwm和74/75-CAN3-gpio被占用

# Board PCB1
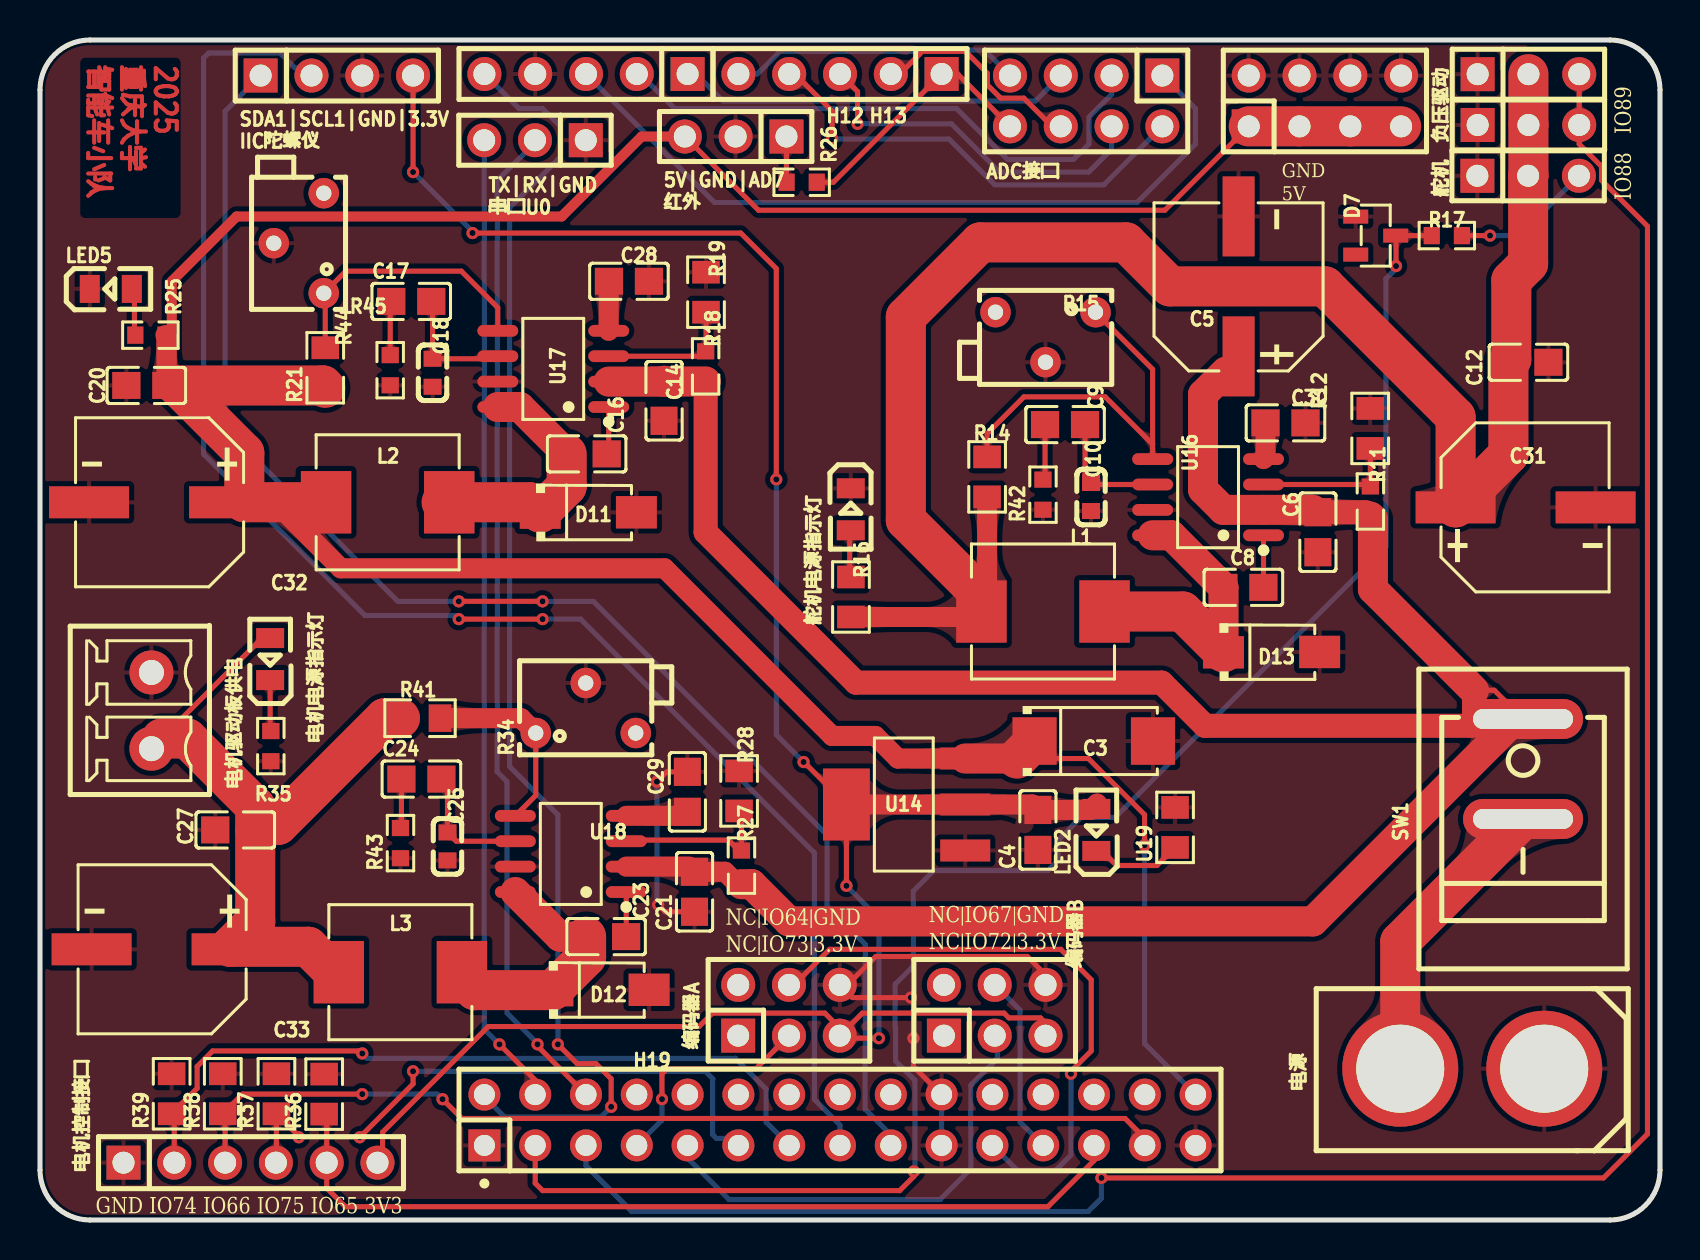
[diagram p1: board, top side]
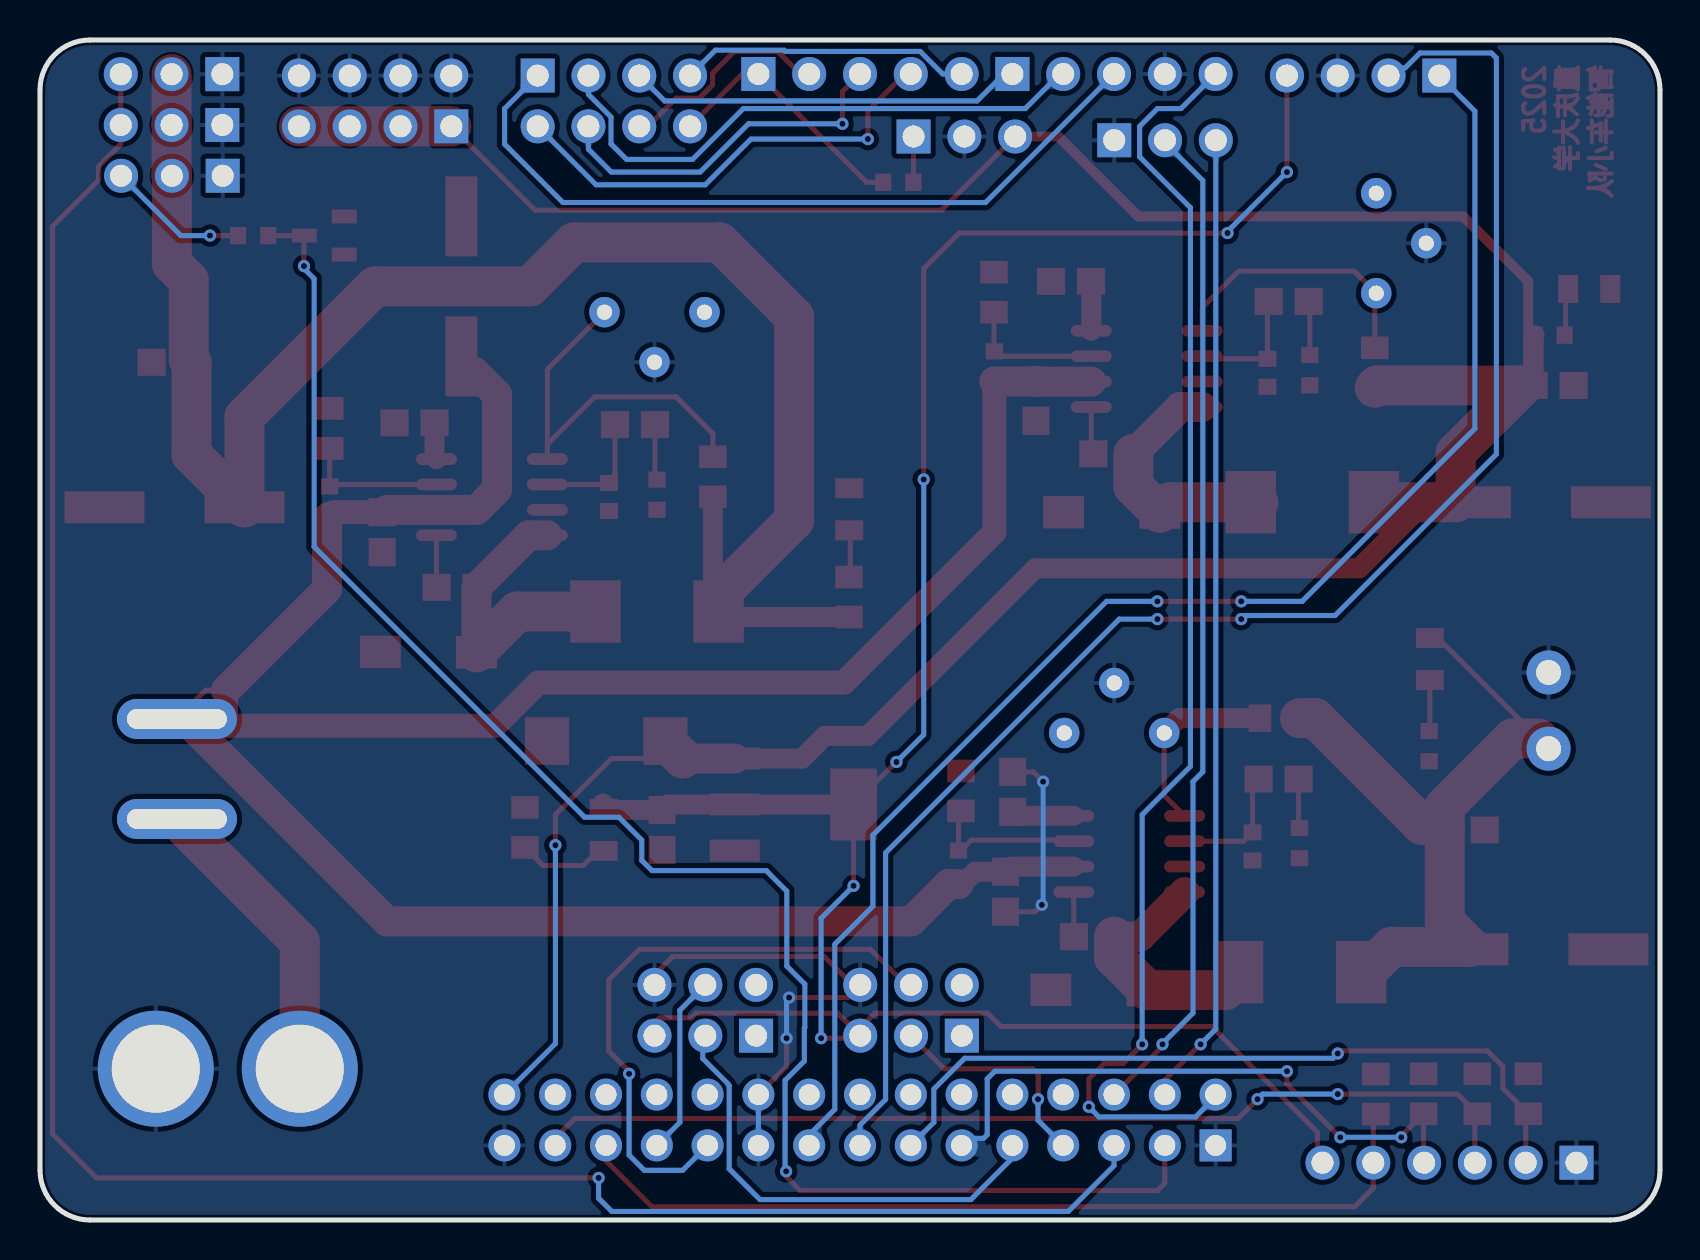
[diagram p2: board, bottom side, seen from below]

Outline 81 x 59 mm; copper layers: Top Layer, Bottom Layer. Coordinates in mm from the lower left corner of the outline.
Outline path: 0,56.5 0,2.5 arc(0.73,0.73) 2.5,0 78.5,0 arc(80.27,0.73) 81,2.5 81,56.5 arc(80.27,58.27) 78.5,59 2.5,59 arc(0.73,58.27) 0,56.5
Stack: Top Layer 0.035mm / Dielectric1 1.51mm FR4 er 4.5 / Bottom Layer 0.035mm

## Design rules (mm)
template: JLCPCB Capability(Two Layers Board)
spacing copperThickness1oz (default): track to track 0.102, other pairs 0.152 to 0.3
spacing copperThickness2oz: track to track 0.203, other pairs 0.152 to 0.3
track width copperThickness1oz (default): min 0.127, default 0.254, max 2.54
track width copperThickness2oz: min 0.203, default 0.254, max 2.54
differential pair differentialPair (default): width min 0.127, default 0.254, max 2.54; gap min 0.152, default 0.152
via viaSize (default): diameter min 0.5, default 0.61, max 10; hole min 0.3, default 0.305, max 6.3

## Placement (name value [footprint] x y rotation side)
5V|GND|AD7
红外  -  [HDR-TH_3P-P2.54-V-M]  34.78 54.17 180 top
ADC接口  -  [HDR-TH_8P-P2.54-V-M-R2-C4-S2.54]  52.31 55.95 180 top
C3  10uF  [CAP-SMD_L6.0-W3.2]  52.69 23.95 0 top
C4  22uF  [C0805]  49.9 19.5 90 top
C5  330uF  [CAP-SMD_BD8.0-L8.3-W8.3-LS9.3-FD-1]  59.93 46.68 90 top
C6  100nF  [C0805]  63.89 34.39 90 top
C8  100nF  [C0805]  60.17 31.63 0 top
C9  2.2nF  [C0805]  51.25 39.77 0 top
C10  22pF  [C0603]  52.55 36.15 90 top
C12  100nF  [C0805]  74.42 42.89 0 top
C14  100nF  [C0805]  31.2 40.96 90 top
C16  100nF  [C0805]  27.33 38.31 0 top
C17  2.2nF  [C0805]  18.56 45.93 0 top
C18  22pF  [C0603]  19.63 42.36 90 top
C20  100nF  [C0805]  5.32 41.73 180 top
C21  100nF  [C0805]  32.73 16.41 90 top
C23  100nF  [C0805]  28.31 14.17 0 top
C24  2.2nF  [C0805]  19.07 22.05 0 top
C25  22pF  [C0603]  20.37 18.68 90 top
C27  100nF  [C0805]  9.76 19.5 180 top
C28  10nF  [C0805]  29.45 46.94 180 top
C29  10nF  [C0805]  32.37 21.41 270 top
C30  10nF  [C0805]  62.27 39.86 180 top
C31  470uF  [CAP-SMD_BD8.0-L8.3-W8.3-LS8.9-FD]  74.28 35.63 0 top
C32  470uF  [CAP-SMD_BD8.0-L8.3-W8.3-LS8.9-FD]  5.95 35.89 180 top
C33  470uF  [CAP-SMD_BD8.0-L8.3-W8.3-LS8.9-FD]  6.08 13.53 180 top
D7  BZX84C4V7  [SOT-23-3_L2.9-W1.3-P1.90-LS2.4-BR]  66.79 49.22 180 top
D11  SS54  [SMA_L4.3-W2.6-LS5.0-RD]  27.42 35.38 0 top
D12  SS54  [SMA_L4.3-W2.6-LS5.0-RD]  28.05 11.5 0 top
D13  SS54  [SMA_L4.3-W2.6-LS5.0-RD]  61.58 28.39 0 top
GND
5V  -  [HDR-TH_8P-P2.54-V-M-R2-C4-S2.54]  64.25 55.95 0 top
H3  PZ254V-11-03P  [HDR-TH_3P-P2.54-V-M]  74.42 57.29 0 top
H12  PZ254V-11-05P  [HDR-TH_5P-P2.54-V-M]  27.3 57.3 180 top
H13  PZ254V-11-05P  [HDR-TH_5P-P2.54-V-M]  40 57.3 180 top
H19  X6521WV-2x15H-C60D30  [HDR-TH_30P-P2.54-V-M-R2-C15-S2.54-BL]  40 5 0 top
L1  4.7uH  [IND-SMD_L7.3-W6.6_MHCI06030]  50.15 30.42 180 top
L2  4.7uH  [IND-SMD_L7.3-W6.6_MHCI06030]  17.38 35.89 180 top
L3  4.7uH  [IND-SMD_L7.3-W6.6_MHCI06030]  18.02 12.39 180 top
LED2  XL-2012SURC  [LED0805-R-RD]  52.82 19.5 90 top
LED5  XL-2012SURC  [LED0805-R-RD]  3.54 46.55 0 top
R11  200kΩ  [R0603]  66.52 35.92 270 top
R12  100kΩ  [R0805]  66.51 39.58 270 top
R14  10kΩ  [R0805]  47.35 37.16 270 top
R15  5kΩ  [RES-ADJ-TH_3P-L6.8-W4.6-P2.50-TL-BS-3266X]  50.28 44.14 270 top
R16  3.3kΩ  [R0805]  40.55 31.15 270 top
R17  2.7kΩ  [R0603]  70.34 49.22 0 top
R18  200kΩ  [R0603]  33.28 42.68 270 top
R19  100kΩ  [R0805]  33.3 46.39 270 top
R21  10kΩ  [R0805]  14.26 42.61 90 top
R25  1kΩ  [R0603]  5.52 44.24 180 top
R26  1kΩ  [R0603]  38.08 51.89 0 top
R27  200kΩ  [R0603]  35.07 17.72 270 top
R28  100kΩ  [R0805]  34.95 21.45 270 top
R34  5kΩ  [RES-ADJ-TH_3P-L6.8-W4.6-P2.50-TL-BS-3266X]  27.29 25.6 90 top
R35  1kΩ  [R0603]  11.54 23.69 270 top
R36  13kΩ  [R0805]  14.21 6.29 90 top
R37  13kΩ  [R0805]  11.82 6.31 90 top
R38  13kΩ  [R0805]  9.14 6.31 90 top
R39  13kΩ  [R0805]  6.58 6.31 90 top
R41  12kΩ  [R0805]  19 25.09 180 top
R42  37.4kΩ  [R0603]  50.15 36.27 90 top
R43  37.4kΩ  [R0603]  18.03 18.84 90 top
R44  37.4kΩ  [R0603]  17.51 42.49 270 top
R45  5kΩ  [RES-ADJ-TH_3P-L6.8-W4.6-P2.50-TL-BS-3266X]  12.94 48.84 180 top
SDA1|SCL1|GND|3.3V
IIC陀螺仪  -  [HDR-TH_4P-P2.54-V-M]  14.84 57.22 0 top
SW1  RS601HL-1010011BB  [SW-TH_RS601HL-1010011BB]  74.15 22.55 270 top
TX|RX|GND
串口U0  -  [HDR-TH_3P-P2.54-V-M]  24.75 53.99 180 top
U14  A1117-3.3  [asm1117]  43.29 20.77 0 top
U16  TPS54331D  [SOIC-8_L4.9-W3.9-P1.27-LS6.0-BL]  58.4 36.14 90 top
U17  TPS54331D  [SOIC-8_L4.9-W3.9-P1.27-LS6.0-BL]  25.66 42.55 90 top
U18  TPS54331D  [SOIC-8_L4.9-W3.9-P1.27-LS6.0-BL]  26.54 18.3 90 top
U19  430Ω  [R0805]  56.75 19.63 90 top
电机控制接口  -  [HDR-TH_6P-P2.54-V-M]  10.53 2.87 0 top
电机电源指示灯  -  [LED0805-R-RD]  11.51 28.05 90 top
电机驱动板供电  -  [CONN-TH_WJ15EDGVC-3.81-2P]  5.57 25.47 270 top
电源  -  [CONN-TH_XT60]  71.61 7.56 180 top
编码器A  -  [HDR-TH_6P-P2.54-V-M-R2-C3-S2.54]  37.45 10.49 0 top
编码器B  -  [HDR-TH_6P-P2.54-V-M-R2-C3-S2.54]  47.74 10.49 0 top
舵机  -  [HDR-TH_3P-P2.54-V-M]  74.41 52.21 0 top
舵机电源指示灯  -  [LED0805-R-RD]  40.54 35.54 270 top
负压驱动  -  [HDR-TH_3P-P2.54-V-M]  74.42 54.75 0 top

## Footprints (pads in the part's own frame, mm; a bottom-side part is the same pattern mirrored in y, then rotated)
asm1117
  rect 2.5x1.1 smd: 1(2.97,-2.3) 2(2.97,0) 3(2.97,2.3)
  rect 2.34x3.6 smd: 2(-2.97,0)
C0603
  rect 0.8x0.9 smd: 1(-0.7,0) 2(0.7,0)
C0805
  rect 1.41x1.35 smd: 1(-1,0) 2(1,0)
CAP-SMD_BD8.0-L8.3-W8.3-LS8.9-FD
  rect 4x1.6 smd: 1(-3.5,0) 2(3.5,0)
CAP-SMD_BD8.0-L8.3-W8.3-LS9.3-FD-1
  rect 4x1.6 smd: 1(-3.5,0) 2(3.5,0)
CAP-SMD_L6.0-W3.2
  rect 2.208x2.376 smd: 1(-2.962,0) 2(2.962,0)
CONN-TH_WJ15EDGVC-3.81-2P
  round 2.2 hole 1.25: 1(-1.905,0) 2(1.905,0)
CONN-TH_XT60
  round 5.8 hole 4.4: 1(-3.6,0) 2(3.6,0)
HDR-TH_3P-P2.54-V-M
  rect 1.7x1.7 hole 1.1: 1(-2.54,0)
  round 1.7 hole 1.1: 2(0,0) 3(2.54,0)
HDR-TH_4P-P2.54-V-M
  rect 1.7x1.7 hole 1.1: 1(-3.81,0)
  round 1.7 hole 1.1: 2(-1.27,0) 3(1.27,0) 4(3.81,0)
HDR-TH_5P-P2.54-V-M
  rect 1.7x1.7 hole 1.1: 1(-5.08,0)
  round 1.7 hole 1.1: 2(-2.54,0) 3(0,0) 4(2.54,0) 5(5.08,0)
HDR-TH_6P-P2.54-V-M
  rect 1.7x1.7 hole 1.1: 1(-6.35,0)
  round 1.7 hole 1.1: 2(-3.81,0) 3(-1.27,0) 4(1.27,0) 5(3.81,0) 6(6.35,0)
HDR-TH_6P-P2.54-V-M-R2-C3-S2.54
  rect 1.7x1.7 hole 1.1: 1(-2.54,-1.27)
  round 1.7 hole 1.1: 2(-2.54,1.27) 3(0,-1.27) 4(0,1.27) 5(2.54,-1.27) 6(2.54,1.27)
HDR-TH_8P-P2.54-V-M-R2-C4-S2.54
  rect 1.7x1.7 hole 1.1: 1(-3.81,-1.27)
  round 1.7 hole 1.1: 2(-3.81,1.27) 3(-1.27,-1.27) 4(-1.27,1.27) 5(1.27,-1.27) 6(1.27,1.27) 7(3.81,-1.27) 8(3.81,1.27)
HDR-TH_30P-P2.54-V-M-R2-C15-S2.54-BL
  rect 1.6x1.6 hole 1.05: 1(-17.78,-1.27)
  round 1.6 hole 1.05: 2(-17.78,1.27) 3(-15.24,-1.27) 4(-15.24,1.27) 5(-12.7,-1.27) 6(-12.7,1.27) 7(-10.16,-1.27) 8(-10.16,1.27) 9(-7.62,-1.27) 10(-7.62,1.27) 11(-5.08,-1.27) 12(-5.08,1.27) 13(-2.54,-1.27) 14(-2.54,1.27) 15(0,-1.27) 16(0,1.27) 17(2.54,-1.27) 18(2.54,1.27) 19(5.08,-1.27) 20(5.08,1.27) 21(7.62,-1.27) 22(7.62,1.27) 23(10.16,-1.27) 24(10.16,1.27) 25(12.7,-1.27) 26(12.7,1.27) 27(15.24,-1.27) 28(15.24,1.27) 29(17.78,-1.27) 30(17.78,1.27)
IND-SMD_L7.3-W6.6_MHCI06030
  rect 2.524x3.12 smd: 1(-3.078,0) 2(3.078,0)
LED0805-R-RD
  rect 1x1.399 smd: 1(1.05,0) 2(-1.05,0)
R0603
  rect 0.806x0.864 smd: 1(-0.753,0) 2(0.753,0)
R0805
  rect 1.133x1.377 smd: 1(-1,0) 2(1,0)
RES-ADJ-TH_3P-L6.8-W4.6-P2.50-TL-BS-3266X
  round 1.524 hole 0.762: 1(-1.25,2.5) 2(1.25,0) 3(-1.25,-2.5)
SMA_L4.3-W2.6-LS5.0-RD
  rect 2.046x1.62 smd: 1(-2.404,-0.009) 2(2.404,0.009)
SOIC-8_L4.9-W3.9-P1.27-LS6.0-BL
  oval 0.588x2.045 smd: 1(-1.905,-2.772) 2(-0.635,-2.772) 3(0.635,-2.772) 4(1.905,-2.772) 5(1.905,2.772) 6(0.635,2.772) 7(-0.635,2.772) 8(-1.905,2.772)
SOT-23-3_L2.9-W1.3-P1.90-LS2.4-BR
  rect 1.25x0.7 smd: 1(1,-0.95) 2(1,0.95) 3(-1,0)
SW-TH_RS601HL-1010011BB
  oval 2x6 hole 1x5: 1(-2.5,0) 2(2.5,0)

## Nets
GND: 5V|GND|AD7
红外.2 C3.2 C4.1 C5.2 C6.1 C10.1 C12.2 C14.1 C18.1 C20.2 C21.1 C25.1 C27.2 C28.1 C29.1 C30.1 C31.2 C32.2 C33.2 D7.1 D11.2 D12.2 D13.2 GND
5V.2 GND
5V.4 GND
5V.6 GND
5V.8 H3.1 H12.4 H19.1 H19.19 H19.20 H19.29 LED5.2 R12.1 R15.2 R19.1 R28.1 R34.2 R35.2 R36.2 R37.2 R38.2 R39.2 R42.1 R43.1 R44.2 R45.2 SDA1|SCL1|GND|3.3V
IIC陀螺仪.3 TX|RX|GND
串口U0.1 U14.1 U16.7 U17.7 U18.7 U19.2 电机控制接口.1 电机驱动板供电.1 电源.1 编码器A.6 编码器B.6 舵机.1 舵机电源指示灯.2 负压驱动.1
P3V3: H12.5 H19.2
VCC3V3: C4.2 LED2.1 SDA1|SCL1|GND|3.3V
IIC陀螺仪.4 U14.2 电机控制接口.6 编码器A.5 编码器B.5
VCC5V: 5V|GND|AD7
红外.3 C3.1 C20.1 C32.1 GND
5V.1 GND
5V.3 GND
5V.5 GND
5V.7 H19.30 L2.2 R21.1 R25.1 U14.3
VCC7.2V: C27.1 C33.1 L3.2 R41.2 电机电源指示灯.1 电机驱动板供电.2
AD0: ADC接口.3 H12.2
AD1: ADC接口.5 H12.1
AD2: ADC接口.2 H13.4
AD3: ADC接口.6 H13.2
AD4: ADC接口.1 H12.3
AD5: ADC接口.7 H13.5
AD6: ADC接口.4 H13.3
AD7: ADC接口.8 H13.1 R26.2
BAT: C5.1 C6.2 C14.2 C21.2 R11.2 R18.2 R27.2 SW1.1 U16.2 U17.2 U18.2
IO64: H19.21 编码器A.4
IO65: H19.25 R36.1 电机控制接口.5
IO66: H19.27 R38.1 电机控制接口.3
IO67: H19.23 编码器B.4
IO72: H19.9 编码器B.3
IO73: H19.7 编码器A.3
IO74: H19.13 R39.1 电机控制接口.2
IO75: H19.11 R37.1 电机控制接口.4
IO88: D7.3 H19.3 R17.1
IO89: H3.3 H19.5 负压驱动.3
RX1: H19.10
SCL1: H19.15 SDA1|SCL1|GND|3.3V
IIC陀螺仪.2
SDA1: H19.17 SDA1|SCL1|GND|3.3V
IIC陀螺仪.1
TX1: H19.8
UART0RX: H19.6 TX|RX|GND
串口U0.2
UART0TX: H19.4 TX|RX|GND
串口U0.3
VADJ: C12.1 C31.1 H3.2 L1.2 R14.2 R16.2 舵机.2 负压驱动.2
VSESE: R34.1 R41.1 U18.5
$1N5106: LED2.2 U19.1
$1N8053: SW1.2 电源.2
$1N8621: R11.1 R12.2 U16.3
$1N9019: C30.2 U16.4
$1N9100: C8.2 U16.1
$1N9333: C9.2 C10.2 U16.6
$1N9888: R14.1 R15.1 U16.5
$1N10078: C8.1 D13.1 L1.1 U16.8
$1N10148: R16.1 舵机电源指示灯.1
$1N10435: R17.2 舵机.3
$1N11574: R18.1 R19.2 U17.3
$1N11589: C28.2 U17.4
$1N11592: C16.2 U17.1
$1N11595: C17.1 R44.1
$1N11601: C17.2 C18.2 U17.6
$1N11624: C16.1 D11.1 L2.1 U17.8
$1N11734: R21.2 R45.1 U17.5
$1N14138: 5V|GND|AD7
红外.1 R26.1
$1N14868: R27.1 R28.2 U18.3
$1N14871: C29.2 U18.4
$1N14872: C23.2 U18.1
$1N14873: C24.1 R43.2
$1N14875: C24.2 C25.2 U18.6
$1N14877: C23.1 D12.1 L3.1 U18.8
$1N28496: R35.1 电机电源指示灯.2
$1N31767: C9.1 R42.2
$1N44983: LED5.1 R25.2

Pads without a net: D7 2; H19 12 14 16 18 22 24 26 28; R15 3; R34 3; R45 3; 编码器A 1 2; 编码器B 1 2

## Via types
v1: diameter 0.61, hole 0.305, Top Layer to Bottom Layer, 33 vias

## Routing (per net, layer and track width the routed paths; a pad name or vN(x,y) marks a point on that pad's centre or on a via; arc(x,y) is an arc through that point)
GND: length 33.5
  Top Layer w0.254: v1(30.91,15.76) 31.25,15.41 C21.1 ; C29.1 31.34,22.41 v1(30.84,21.92) ; H19.20 43.67,7.68 v1(43.67,9.09) ; v1(43.54,11.12) 40.62,11.12 编码器A.6 40.24,12.01 40.62,12.01 41.79,13.18 49.36,13.18 50.28,12.26 编码器B.6
  Bottom Layer w0.254: v1(30.91,15.76) 30.84,15.82 v1(30.84,21.92) ; v1(43.67,9.09) 43.67,10.99 v1(43.54,11.12) ; H19.20 H19.19
P3V3: length 64.7
  Top Layer w0.254: v1(25.89,8.78) 26.86,7.82 27.8,7.82 28.56,7.06 v1(28.56,5.66)
  Bottom Layer w0.254: v1(25.89,8.78) 25.89,20.27 23.48,22.68 23.48,50.62 26.02,53.16 26.02,54.68 25.13,55.57 23.95,55.57 H12.5 ; v1(28.56,5.66) 28.05,5.15 23.22,5.15 22.22,6.16 H19.2
VCC3V3: length 119.7
  Top Layer w0.254: SDA1|SCL1|GND|3.3V
IIC陀螺仪.4 v1(18.65,52.4) ; v1(38.18,22.9) 38.19,22.9 U14.2 v1(40.32,16.71) ; 编码器B.5 50.28,9.85 50.02,10.1 48.44,10.1 48.2,10.34 41.12,10.34 编码器A.5 ; v1(21.62,49.35) 35.04,49.35 36.81,47.57 v1(36.81,37.03) ; 编码器A.5 39.99,9.6 39.24,10.34 33.62,10.34 32.95,9.67 22.41,9.67 17.13,4.39 17.13,3.12 电机控制接口.6 ; 编码器A.5 40.12,9.09 v1(41.94,9.09)
  Top Layer w1: U14.2 U14.2 49.62,20.77 C4.2 52.53,20.5 52.85,20.82
  Bottom Layer w0.254: v1(21.62,49.35) 21.62,49.42 v1(18.65,52.4) ; v1(38.18,22.9) 36.81,24.27 v1(36.81,37.03) ; v1(40.32,16.71) 41.94,15.08 v1(41.94,9.09)
VCC5V: length 160.2
  Top Layer w0.254: 5V|GND|AD7
红外.3 35.93,50.49 56.25,50.49 GND
5V.1 ; 48.85,23.07 52.42,23.07 55.23,20.27 v1(55.23,18.74)
  Top Layer w0.5: 5V|GND|AD7
红外.3 30.08,54.17 26.09,50.18 9.83,50.18 6.59,46.94 6.59,42 C20.1
  Top Layer w1: C20.1 6.32,44.2 R25.1 ; 11.74,35.89 15.04,32.58 31.23,32.58 39.61,24.2 41.77,24.2 42.9,23.07 U14.3
  Top Layer w1.5: 48.85,23.07 U14.3
  Top Layer w2: 13.92,35.89 10.22,35.89 10.22,38.36 6.84,41.73 14.14,41.73 R21.1 ; GND
5V.7 GND
5V.5 GND
5V.3 GND
5V.1 ; C3.1 48.85,23.07
  Bottom Layer w0.254: H19.30 55.23,8.82 v1(55.23,18.74)
VCC7.2V: length 37.5
  Top Layer w0.254: 电机驱动板供电.2 11.1,29.1 电机电源指示灯.1
  Top Layer w2: C27.1 11.02,19.76 11.91,19.76 17.24,25.09 R41.2 ; C27.1 10.76,14.92 9.51,13.66 13.42,13.66 14.94,12.14 ; C27.1 10.76,20.67 7.36,24.08 6.08,24.08
AD0: length 28.6
  Bottom Layer w0.254: H12.2 30,57.3 31.73,55.57 45.83,55.57 48.37,53.03 51.67,53.03 52.45,53.81 52.45,55.15 53.58,56.28 ADC接口.3
AD1: length 19.7
  Bottom Layer w0.254: ADC接口.5 49.77,55.95 34.15,55.95 32.8,57.3 H12.1
AD2: length 23
  Top Layer w0.254: v1(39.61,54.05) 39.61,55.44 37.75,57.3 H13.4
  Bottom Layer w0.254: v1(39.61,54.05) 45.45,54.05 47.74,51.76 53.2,51.76 ADC接口.2
AD3: length 10.9
  Top Layer w0.254: ADC接口.6 50.91,54.81 50.48,54.81 49.19,56.09 48.03,56.09 47.37,56.75 47.37,57.33 46.28,58.43 44.11,58.43 43.95,58.27 43.95,58.26 43.12,57.43 42.67,57.43 H13.2
AD4: length 38.5
  Bottom Layer w0.254: ADC接口.1 57.77,55.57 57.77,53.79 54.85,50.87 33.73,50.87 H12.3
AD5: length 14.6
  Bottom Layer w0.254: ADC接口.7 47.23,58.49 43.8,58.49 43.74,58.43 36.99,58.43 35.86,57.3 H13.5
AD6: length 18.2
  Top Layer w0.254: H13.3 40.88,56.42 v1(40.88,54.81)
  Bottom Layer w0.254: ADC接口.4 53.58,53.54 52.44,52.4 47.99,52.4 45.58,54.81 v1(40.88,54.81)
AD7: length 13
  Top Layer w0.254: R26.2 39.67,51.89 H13.1 45.88,57.3 ADC接口.8
BAT: length 134.8
  Top Layer w0.254: SW1.1 72.72,26.49 71.7,26.49
  Top Layer w1: C21.2 34.25,17.41 34.82,16.84 35.07,16.84 ; U18.2 32.47,17.67
  Top Layer w1.2: 71.7,26.49 71.7,24.84 71.57,24.71 58.24,24.71 56.08,26.87 40.8,26.87 33.28,34.39 R18.2 ; C6.2 66.3,35.39
  Top Layer w1.5: 66.52,35.17 66.65,35.04 66.65,31.54 71.7,26.49 ; 74.03,25.05 73.77,25.05 63.65,14.93 37.44,14.93 35.58,16.79 35.07,16.79 ; 63.65,35.5 U16.2 59.17,35.5 58.15,36.52 58.15,41.28 59.29,42.42 ; 28.43,41.92 31.16,41.92 C14.2 31.23,41.93 R18.2
IO64: length 30.4
  Top Layer w0.254: v1(51.55,7.31) 51.55,7.44 52.56,8.45 52.56,12.01 51.04,13.53 39.48,13.53 38.08,12.14 37.83,12.14 编码器A.4
  Bottom Layer w0.254: H19.21 48.87,2.49 50.78,2.49 51.55,3.25 v1(51.55,7.31)
IO65: length 44.2
  Top Layer w0.254: H19.25 52.7,2.97 50.4,0.66 15.27,0.66 14.33,1.6 电机控制接口.5 14.33,5.17 R36.1
IO66: length 50.3
  Top Layer w0.254: v1(16.11,6.29) 10.12,6.29 R38.1 9.25,5.19 电机控制接口.3 ; v1(20.13,6.04) 21.09,5.08 54.25,5.08 55.24,4.09 H19.27
  Bottom Layer w0.254: v1(16.11,6.29) 19.87,6.29 v1(20.13,6.04)
IO67: length 9
  Bottom Layer w0.254: 编码器B.4 49.01,10.49 49.01,4.88 H19.23
IO72: length 23.5
  Bottom Layer w0.254: H19.9 32.51,3.6 32.51,2.97 34.45,1.02 45,1.02 46.54,2.56 46.54,6.72 46.59,6.77 46.59,6.8 47.86,8.07 47.86,9.09 编码器B.3
IO73: length 11.2
  Top Layer w0.254: 编码器A.3 35.8,7.56 31.35,7.56 31.1,7.31 v1(31.1,6.04)
  Bottom Layer w0.254: v1(31.1,6.04) 31.1,4.99 H19.7
IO74: length 38.3
  Top Layer w0.254: 电机控制接口.2 6.72,5.18 R39.1 7.86,6.59 7.86,7.68 8.63,8.45 15.99,8.45 v1(16.11,8.33)
  Bottom Layer w0.254: v1(16.11,8.33) 16.35,8.09 34.77,8.09 36.31,6.55 36.31,4.88 H19.13
IO75: length 31
  Top Layer w0.254: 电机控制接口.4 11.82,2.89 R37.1 12.94,4.2 v1(12.94,4.14) ; v1(18.65,7.44) 18.65,6.8 v1(15.99,4.14)
  Bottom Layer w0.254: v1(18.65,7.44) 33.26,7.44 33.64,7.06 33.64,4.26 33.82,4.08 34.57,4.08 H19.11 ; v1(15.99,4.14) v1(12.94,4.14)
IO88: length 85.3
  Top Layer w0.254: v1(43.69,2.43) 43.69,2.18 42.98,1.47 25.13,1.47 24.76,1.84 H19.3 ; v1(67.8,47.7) 67.8,49.2 D7.3 R17.1
  Bottom Layer w0.254: v1(43.69,2.43) 43.75,2.49 43.75,6.98 42.78,7.95 42.78,9.6 42.76,9.62 42.76,11.8 43.66,12.7 43.66,16.44 44.69,17.47 50.4,17.47 50.91,17.98 50.91,19 52.05,20.14 53.77,20.14 67.29,33.66 67.29,47.06 67.8,47.57 v1(67.8,47.7)
IO89: length 111.6
  Top Layer w0.254: H3.3 负压驱动.3 76.96,53.79 78.07,52.68 78.07,51.99 80.37,49.69 80.37,4.3 78.18,2.1 v1(53.07,2.1)
  Bottom Layer w0.254: H19.5 27.3,2.71 29.59,0.43 52.41,0.43 53.07,1.09 v1(53.07,2.1)
SCL1: length 79.7
  Top Layer w0.254: v1(25.13,30.04) v1(20.94,30.04)
  Bottom Layer w0.254: H19.15 40,4.74 38.72,6.03 38.72,18.36 27.03,30.04 v1(25.13,30.04) ; v1(20.94,30.04) 20.76,30.22 16.25,30.22 8.18,38.29 8.18,58.1 8.43,58.35 12,58.35 12.75,57.6 13.19,57.6 13.57,57.22
SDA1: length 73.7
  Top Layer w0.254: v1(25.13,30.93) v1(20.94,30.93)
  Bottom Layer w0.254: SDA1|SCL1|GND|3.3V
IIC陀螺仪.1 9.25,55.44 9.25,39.57 17.89,30.93 v1(20.94,30.93) ; v1(25.13,30.93) 27.67,30.93 39.35,19.25 39.35,15.69 41.26,13.79 41.26,5.53 42.54,4.25 H19.17
UART0RX: length 50.3
  Top Layer w0.254: v1(24.88,8.78) 24.88,8.69 H19.6
  Bottom Layer w0.254: TX|RX|GND
串口U0.2 24.75,53.86 22.86,51.97 22.86,22.41 23.35,21.92 23.35,10.34 24.88,8.82 v1(24.88,8.78)
UART0TX: length 48.8
  Top Layer w0.254: v1(22.97,8.78) 24.76,7 H19.4
  Bottom Layer w0.254: TX|RX|GND
串口U0.3 22.21,9.55 v1(22.97,8.78)
VADJ: length 88.4
  Top Layer w1: R14.2 47.35,30.71 ; R16.2 46.8,30.15 L1.2
  Top Layer w2: 46.97,30.68 46.97,31.31 43.29,35 43.29,45.16 47.01,48.88 54.3,48.88 56.5,46.68 64.25,46.68 70.78,40.15 C31.1 73.42,38.28 C12.1 73.56,43.03 73.56,46.98 74.41,47.82 舵机.2 74.42,52.23 负压驱动.2 H3.2
VSESE: length 9.7
  Top Layer w0.254: U18.5 24.79,21.23 R34.1
  Top Layer w1: R41.1 24.05,25.09 R34.1
$1N5106: length 4.6
  Top Layer w0.254: LED2.2 53.1,18.45 53.83,17.72 55.85,17.72 U19.1
$1N8053: length 15
  Top Layer w2: 电源.2 68.01,13.91 SW1.2
$1N8621: length 7.3
  Top Layer w0.254: U16.3 66.42,36.78 R11.1 66.52,38.57 R12.2
$1N9019: length 1.9
  Top Layer w1: U16.4 61.27,38.14 C30.2
$1N9100: length 2.6
  Top Layer w0.254: U16.1 61.18,31.64 C8.2
$1N9333: length 6.1
  Top Layer w0.254: C9.2 52.25,37.28 52.75,36.78 U16.6
$1N9888: length 19.7
  Top Layer w0.254: 55.63,38.79 55.63,42.54 R15.1 ; 55.63,38.79 U16.5 ; 55.63,38.79 53.26,41.16 49.2,41.16 47.35,39.31 R14.1
$1N10078: length 14.7
  Top Layer w1.5: D13.1 59.18,31.63 ; U16.8 56.57,34.23 C8.1
  Top Layer w2: D13.1 57.13,30.42 L1.1
$1N10148: length 2
  Top Layer w0.254: R16.1 40.49,32.21 40.49,34.08
$1N10435: length 7.1
  Top Layer w0.254: R17.2 v1(72.5,49.22)
  Bottom Layer w0.254: v1(72.5,49.22) 73.96,49.22 舵机.3
$1N11574: length 6.9
  Top Layer w0.254: R19.2 33.3,43.45 R18.1 33.04,43.19 28.43,43.19
$1N11589: length 2.5
  Top Layer w1: 28.43,44.46 28.43,46.92 C28.2
$1N11592: length 2.4
  Top Layer w0.254: 28.43,40.65 28.43,38.41 C16.2
$1N11595: length 2.7
  Top Layer w0.254: C17.1 17.51,45.88 R44.1
$1N11601: length 6.2
  Top Layer w0.254: U17.6 22.76,43.06 C18.2 19.63,45.86 C17.2
$1N11624: length 13
  Top Layer w1.5: C16.1 23.99,40.65 U17.8
  Top Layer w2: 20.08,35.89 24.49,35.89 D11.1 26.33,36.69 C16.1
$1N11734: length 13.8
  Top Layer w0.254: U17.5 22.89,45.62 21.07,47.44 15.29,47.44 R45.1 14.26,46.27 R21.2
$1N14138: length 2.3
  Top Layer w0.254: 5V|GND|AD7
红外.1 37.32,51.9 R26.1
$1N14868: length 8.2
  Top Layer w0.254: U18.3 29.37,19 34.42,19 35.07,18.35 35.07,20.34 R28.2
$1N14871: length 3.1
  Top Layer w1: U18.4 31.95,20.21 32.26,20.52
$1N14872: length 2.2
  Top Layer w0.254: U18.1 29.31,14.18 C23.2
$1N14873: length 2.5
  Top Layer w0.254: 18.01,19.55 18.07,19.61 C24.1
$1N14875: length 6.4
  Top Layer w0.254: U18.6 20.82,18.94 C25.2 20.37,21.74 C24.2
$1N14877: length 12.6
  Top Layer w1.5: U18.8 26,14.17 C23.1
  Top Layer w2: 21.1,12.14 21.74,11.49 D12.1 27.31,13.15 C23.1
$1N28496: length 2.6
  Top Layer w0.254: 11.67,24.45 11.51,24.61 电机电源指示灯.2
$1N31767: length 2.8
  Top Layer w0.254: C9.1 50.25,37.12 R42.2
$1N44983: length 1.8
  Top Layer w0.254: 4.72,46.05 4.72,44.29 R25.2

## Copper pours and planes (outline as drawn; the poured copper is in the pictures)
GND on Top Layer: -4.84,65.73 86.85,65.73 86.85,-4.25 -4.84,-4.25
GND on Bottom Layer: -3.19,67 85.71,67 85.71,-3.23 -3.19,-3.23

Small or netless copper shapes (teardrops, artwork), in the pictures only: 147 on Top Layer, 53 on Bottom Layer

## Text on the board
Top Layer: 2025 / 重庆大学 / 智能车小队
Top Silkscreen Layer: NC|IO64|GND / NC|IO73|3.3V | NC|IO67|GND / NC|IO72|3.3V | IO88 | GND IO74 IO66 IO75 IO65 3V3 | IO89
